# EAGLE board LDAQ-BASE (EAGLE 9.6.2)
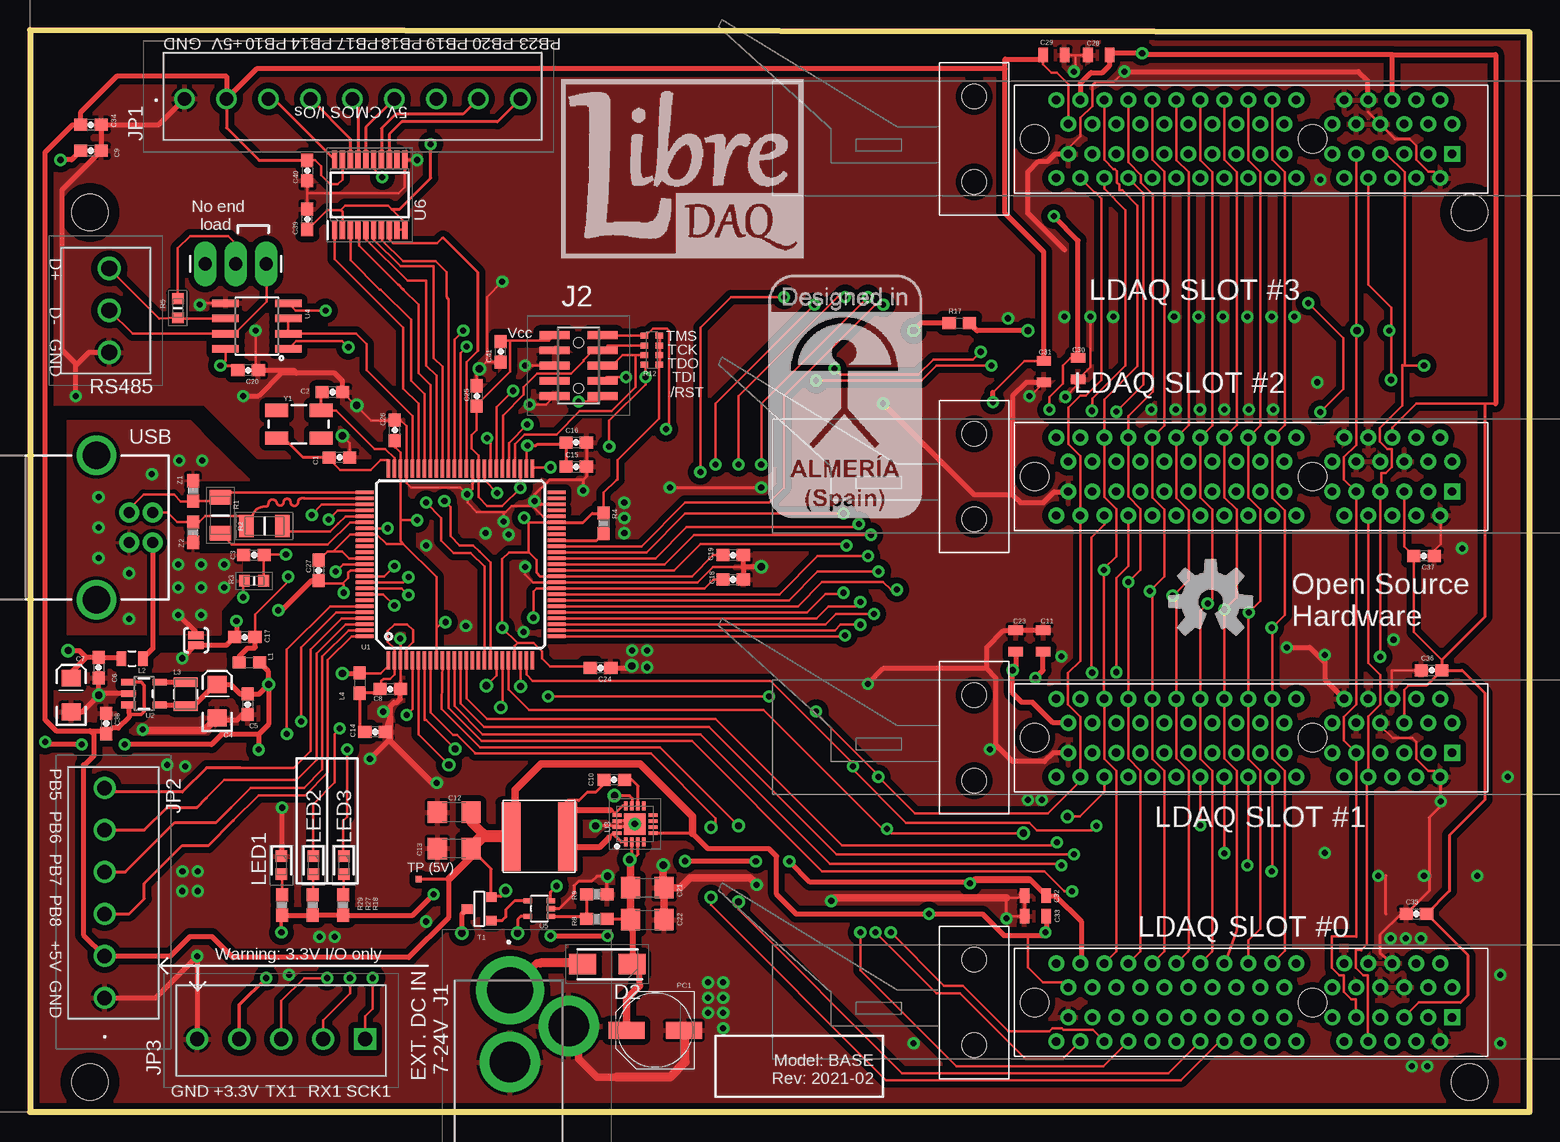
[diagram p2: board, top side]
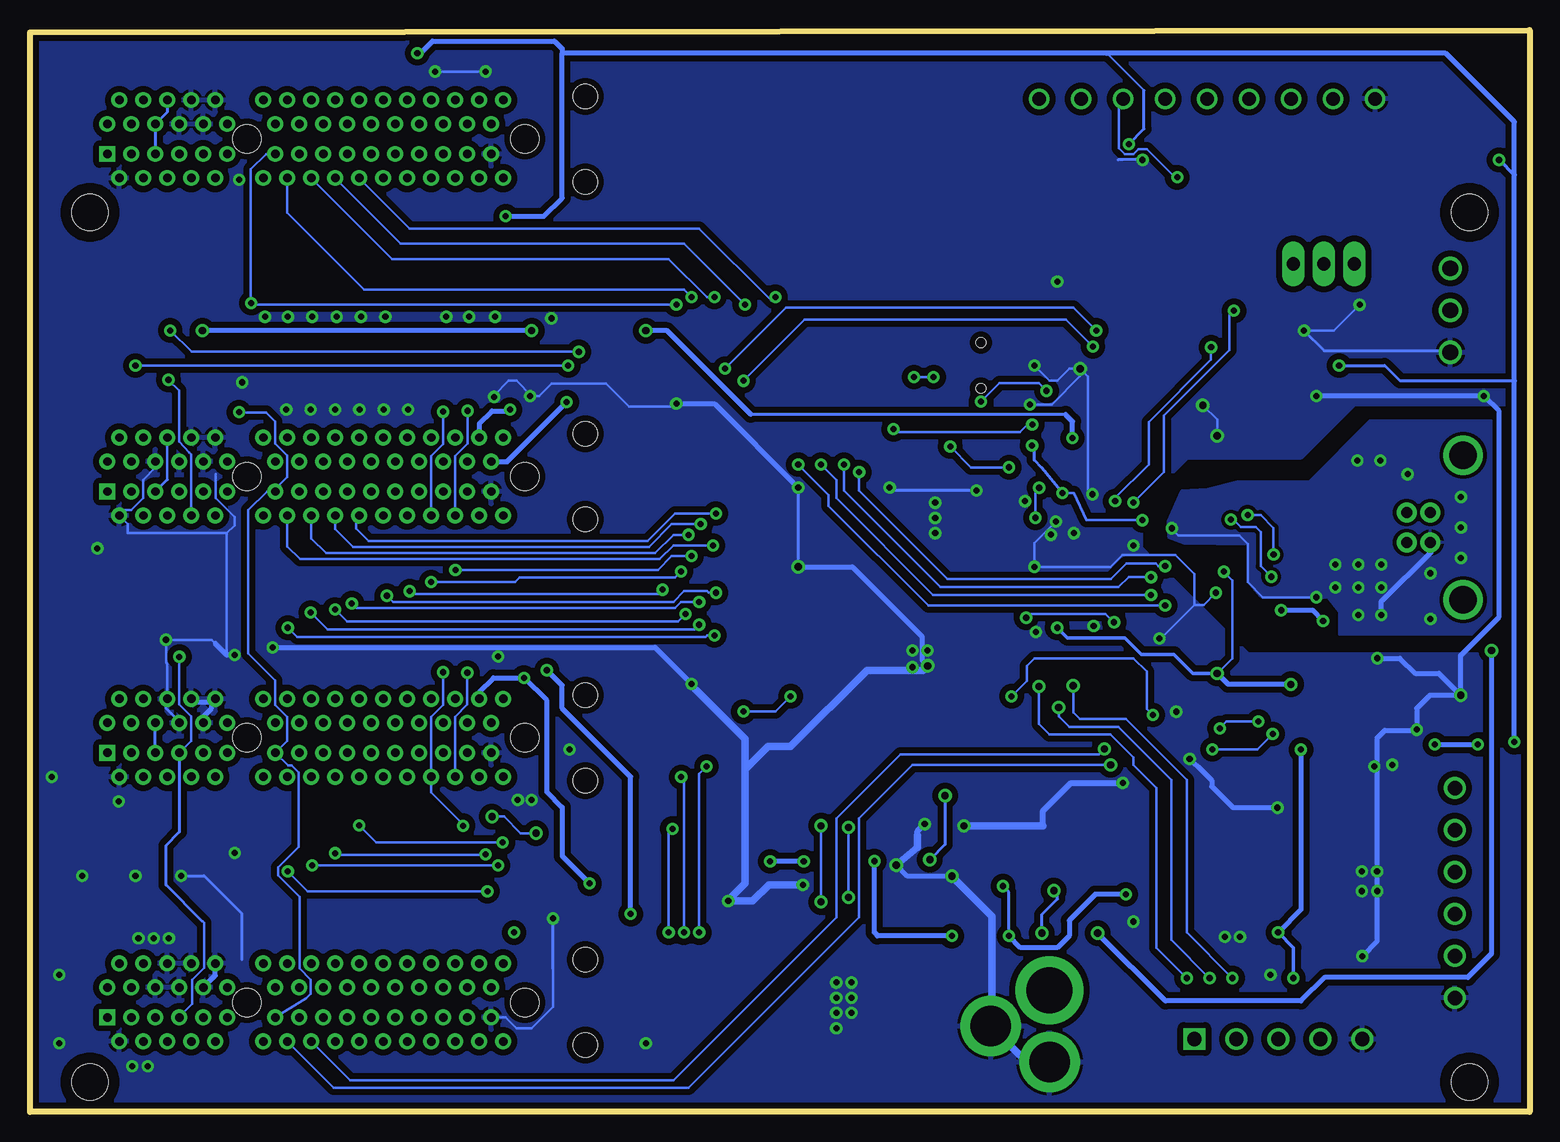
[diagram p3: board, bottom side, seen from below]

Size 125 x 90.2 mm. Coordinates in mm from the lower left corner, seen from the top.
Outline: 0,0 125,0 125,90 0,90.2 0,0
Copper layers (1*16): Top 0.035mm / dielectric 1.5mm / Bottom 0.035mm
Design rules "LibreDAQ": minimum track width 8mil, minimum drill 20mil, track to track 8mil, track to pad 7mil, pad to pad 7mil, via to via 8mil, smd to smd 7mil, copper to edge 6mil, drill to drill 8mil, minimum pad ring 12mil, minimum via ring 10mil, stop-mask expansion 4mil, vias tented up to drill 25mil, thermal gap 10mil

## Footprints (pad centres in the part's own frame; a part is rotated, then mirrored left to right if it is on the bottom)
0603-CAP = smd 1.1 x 1: 1 -0.85,0; 2 0.85,0
EIA3216 = smd 1.4 x 1.6: A 1.4,0; C -1.4,0
0805 = smd 0.8 x 1.2: 1 -0.9,0; 2 0.9,0
1206 = smd 1.6 x 1.8: 1 -1.4,0; 2 1.4,0
DIOM5025X231N = smd 2.25 x 1.7: 1 -2.05,0; 2 2.05,0
48402211 = drill 3.84 pad 5.66: 1 0,0 | drill 3.36 pad 5.04: 2 0,-6; 3 4.9,-3
M503610542 = smd 0.65 x 2.5: 1 -2.54,-2; 2 -2.54,2; 3 -1.27,-2; 4 -1.27,2; 5 0,-2; 6 0,2; 7 1.27,-2; 8 1.27,2; 9 2.54,-2; 10 2.54,2 | hole 0.8: -1.905,0; 1.905,0
393570009 = drill 1.1 pad 1.65: 1 0,0; 2 3.5,0; 3 7,0; 4 10.5,0; 5 14,0; 6 17.5,0; 7 21,0; 8 24.5,0; 9 28,0
1984659 = drill 1.2 pad 1.8: 1 0,0; 2 3.5,0; 3 7,0; 4 10.5,0; 5 14,0; 6 17.5,0
1984646 = drill 1.2 pad 1.8 square: 1 0,0 | drill 1.2 pad 1.8: 2 3.5,0; 3 7,0; 4 10.5,0; 5 14,0
691214110003 = drill 1.3 pad 1.95: 1 0,0; 2 3.5,0; 3 7,0
0603 = smd 1.1 x 1: 1 -0.85,0; 2 0.85,0
1007 = smd 2 x 0.8: 1 0,1; 2 0,-1
INDUCTOR_6028 = smd 1.6 x 5.7: 1 2.35,0; 2 -2.35,0
LEDC1608X80N = smd 0.95 x 0.95: 1 -0.75,0; 2 0.75,0
PANASONIC_D = smd 3 x 1.4: + 2.4,0; - -2.4,0
PAD-JUMPER-2-NC_BY_PASTE_YES_SILK = smd 0.635 x 1.27: 1 -0.401,0; 2 0.413,0
RESC3216X75N = smd 1.2 x 1.8: 1 -1.5,0; 2 1.5,0
RESC1608X55N = smd 0.9 x 0.95: 1 -0.8,0; 2 0.8,0
0603-RES = smd 1.1 x 1: 1 -0.85,0; 2 0.85,0
0603-ARV = smd 0.5 x 0.65: 1 -1.2,-0.625; 2 -0.4,-0.625; 3 0.4,-0.625; 4 1.2,-0.625; 5 1.2,0.625; 6 0.4,0.625; 7 -0.4,0.625; 8 -1.2,0.625
0603@1 = smd 1.1 x 1: 1 -0.85,0; 2 0.85,0
1X03_LONGPADS = drill 1.118 pad 1.88 long: 1 0,0; 2 2.54,0; 3 5.08,0
PCI-E_64_PTH_CONN = drill 0.7 square: A1 -11.65,1.25 | drill 0.7: A2 -10.65,3.25; A3 -9.65,1.25; A4 -8.65,3.25; A5 -7.65,1.25; A6 -6.65,3.25; A7 -5.65,1.25; A8 -4.65,3.25; A9 -3.65,1.25; A10 -2.65,3.25; A11 -1.65,1.25; A12 1.35,3.25; A13 2.35,1.25; A14 3.35,3.25; A15 4.35,1.25; A16 5.35,3.25; A17 6.35,1.25; A18 7.35,3.25; A19 8.35,1.25; A20 9.35,3.25; A21 10.35,1.25; A22 11.35,3.25; A23 12.35,1.25; A24 13.35,3.25; A25 14.35,1.25; A26 15.35,3.25; A27 16.35,1.25; A28 17.35,3.25; A29 18.35,1.25; A30 19.35,3.25; A31 20.35,1.25; A32 21.35,3.25; B1 -11.65,-1.25; B2 -10.65,-3.25; B3 -9.65,-1.25; B4 -8.65,-3.25; B5 -7.65,-1.25; B6 -6.65,-3.25; B7 -5.65,-1.25; B8 -4.65,-3.25; B9 -3.65,-1.25; B10 -2.65,-3.25; B11 -1.65,-1.25; B12 1.35,-3.25; B13 2.35,-1.25; B14 3.35,-3.25; B15 4.35,-1.25; B16 5.35,-3.25; B17 6.35,-1.25; B18 7.35,-3.25; B19 8.35,-1.25; B20 9.35,-3.25; B21 10.35,-1.25; B22 11.35,-3.25; B23 12.35,-1.25; B24 13.35,-3.25; B25 14.35,-1.25; B26 15.35,-3.25; B27 16.35,-1.25; B28 17.35,-3.25; B29 18.35,-1.25; B30 19.35,-3.25; B31 20.35,-1.25; B32 21.35,-3.25 | hole 2.35: 0,0; 23.15,0 | hole 2.032: 28.2,3.556; 28.2,-3.556
SOT-23 = smd 0.787 x 0.889: 1 0.025,-1.016; 2 -0.94,1.016; 3 0.991,1.016
PAD.02X.02 = smd 0.508 x 0.508: P$1 0,0
TQFP100 = smd 1.5 x 0.3: 1 -8,6; 2 -8,5.5; 3 -8,5; 4 -8,4.5; 5 -8,4; 6 -8,3.5; 7 -8,3; 8 -8,2.5; 9 -8,2; 10 -8,1.5; 11 -8,1; 12 -8,0.5; 13 -8,0; 14 -8,-0.5; 15 -8,-1; 16 -8,-1.5; 17 -8,-2; 18 -8,-2.5; 19 -8,-3; 20 -8,-3.5; 21 -8,-4; 22 -8,-4.5; 23 -8,-5; 24 -8,-5.5; 25 -8,-6; 51 8,-6; 52 8,-5.5; 53 8,-5; 54 8,-4.5; 55 8,-4; 56 8,-3.5; 57 8,-3; 58 8,-2.5; 59 8,-2; 60 8,-1.5; 61 8,-1; 62 8,-0.5; 63 8,0; 64 8,0.5; 65 8,1; 66 8,1.5; 67 8,2; 68 8,2.5; 69 8,3; 70 8,3.5; 71 8,4; 72 8,4.5; 73 8,5; 74 8,5.5; 75 8,6 | smd 0.3 x 1.5: 26 -6,-8; 27 -5.5,-8; 28 -5,-8; 29 -4.5,-8; 30 -4,-8; 31 -3.5,-8; 32 -3,-8; 33 -2.5,-8; 34 -2,-8; 35 -1.5,-8; 36 -1,-8; 37 -0.5,-8; 38 0,-8; 39 0.5,-8; 40 1,-8; 41 1.5,-8; 42 2,-8; 43 2.5,-8; 44 3,-8; 45 3.5,-8; 46 4,-8; 47 4.5,-8; 48 5,-8; 49 5.5,-8; 50 6,-8; 76 6,8; 77 5.5,8; 78 5,8; 79 4.5,8; 80 4,8; 81 3.5,8; 82 3,8; 83 2.5,8; 84 2,8; 85 1.5,8; 86 1,8; 87 0.5,8; 88 0,8; 89 -0.5,8; 90 -1,8; 91 -1.5,8; 92 -2,8; 93 -2.5,8; 94 -3,8; 95 -3.5,8; 96 -4,8; 97 -4.5,8; 98 -5,8; 99 -5.5,8; 100 -6,8
TOP23-5 = smd 0.55 x 1.2: 1 -0.95,-1.3; 2 0,-1.3; 3 0.95,-1.3; 4 0.95,1.3; 5 -0.95,1.3
QFN50P300X300X100-17N = smd 0.75 x 0.3: 1 -1.5,0.75; 2 -1.5,0.25; 3 -1.5,-0.25; 4 -1.5,-0.75; 9 1.5,-0.75; 10 1.5,-0.25; 11 1.5,0.25; 12 1.5,0.75 | smd 0.3 x 0.75: 5 -0.75,-1.5; 6 -0.25,-1.5; 7 0.25,-1.5; 8 0.75,-1.5; 13 0.75,1.5; 14 0.25,1.5; 15 -0.25,1.5; 16 -0.75,1.5 | smd 1.8 x 1.8: 17 0,0
SOIC8 = smd 0.61 x 2.21: 1 -0.635,-2.616; 2 0.635,-2.616; 3 1.905,-2.616; 4 3.175,-2.616; 5 3.175,2.616; 6 1.905,2.616; 7 0.635,2.616; 8 -0.635,2.616
SOT353-SC70-5 = smd 0.42 x 0.7: 1 -0.65,-0.95; 2 0,-0.95; 3 0.65,-0.95; 4 0.65,0.95; 5 -0.65,0.95
SOP65P640X120-20N = smd 1.475 x 0.45: 1 -2.938,2.925; 2 -2.938,2.275; 3 -2.938,1.625; 4 -2.938,0.975; 5 -2.938,0.325; 6 -2.938,-0.325; 7 -2.938,-0.975; 8 -2.938,-1.625; 9 -2.938,-2.275; 10 -2.938,-2.925; 11 2.938,-2.925; 12 2.938,-2.275; 13 2.938,-1.625; 14 2.938,-0.975; 15 2.938,-0.325; 16 2.938,0.325; 17 2.938,0.975; 18 2.938,1.625; 19 2.938,2.275; 20 2.938,2.925
STAND-OFF-TIGHT = hole 3.048: 0,0
USB-B-PTH = drill 0.914 pad 1.676: D+ 0,1.25; D- 1.981,1.25; GND 0,-1.25; VBUS 1.981,-1.25 | drill 2.286: S1 -2.718,-6.02; S2 -2.718,6.02
CRYSTAL-SMD-5X3 = smd 1.9 x 1.1: 1 -1.85,-1.15; 2 1.85,-1.15; 3 1.85,1.15; 4 -1.85,1.15

## Placement (x,y rotation side)
C1  10pF  [0603-CAP]  25.79,54.58 180 top
C2  10pF  [0603-CAP]  25.21,60.01 180 top
C3  10pF  [0603-CAP]  18.67,46.44 0 top
C4  10uF  [EIA3216]  15.61,34.25 90 top
C5  0.1uF  [0603-CAP]  18.14,33.99 270 top
C6  100nF  [0603-CAP]  5.71,37.04 270 top
C7  10uF  [EIA3216]  3.43,34.76 90 top
C8  0.1uF  [0603-CAP]  30.04,35.25 180 top
C9  0.1uF  [0603-CAP]  5.08,80.14 180 top
C10  22nF  [0603-CAP]  48.71,27.7 180 top
C11  1uF  [0805]  84.47,39.26 90 top
C12  22uF  [1206]  35.36,24.99 180 top
C13  22uF  [1206]  35.36,21.96 180 top
C14  10uF  [0603-CAP]  28.77,31.69 180 top
C15  4.7uF  [0603-CAP]  45.53,53.79 0 top
C16  0.1uF  [0603-CAP]  45.53,55.82 0 top
C17  0.1uF  [0603-CAP]  17.91,39.58 180 top
C18  0.1uF  [0603-CAP]  58.61,44.39 0 top
C19  0.1uF  [0603-CAP]  58.61,46.42 180 top
C20  1.0uF  [0603-CAP]  18.19,61.83 180 top
C21  10uF  [1206]  51.45,18.7 0 top
C22  10uF  [1206]  51.46,16.03 0 top
C23  1uF  [0805]  82.18,39.27 90 top
C24  0.1uF  [0603-CAP]  47.56,37.02 180 top
C25  0.1uF  [0603-CAP]  37.25,59.69 270 top
C26  0.1uF  [0603-CAP]  30.42,56.84 90 top
C27  0.1uF  [0603-CAP]  24.07,45.15 270 top
C28  1uF  [0805]  89.09,88.11 180 top
C29  1uF  [0805]  85.35,88.11 0 top
C30  1uF  [0805]  87.37,61.97 270 top
C31  1uF  [0805]  84.52,61.72 270 top
C32  1uF  [0805]  83.81,18.04 180 top
C33  1uF  [0805]  83.81,16.32 180 top
C34  0.1uF  [0603-CAP]  5.08,82.3 180 top
C35  0.1uF  [0603-CAP]  115.57,16.51 0 top
C36  0.1uF  [0603-CAP]  116.84,36.83 0 top
C37  0.1uF  [0603-CAP]  116.2,46.35 180 top
C38  4.7uF  [0603-CAP]  6.35,32.38 270 top
C39  0.1uF  [0603-CAP]  23.11,74.42 90 top
C40  0.1uF  [0603-CAP]  23.11,78.49 270 top
C41  0.1uF  [0603-CAP]  39.24,63.37 90 top
D2  FM4004W-W  [DIOM5025X231N]  48.13,12.32 180 top
J1  4840.2211  [48402211]  40.01,10.16 0 top
J2  M50-3610542  [M503610542]  45.72,62.23 270 top
JP1  39357-0009  [393570009]  12.88,84.46 0 top
JP2  1984659  [1984659]  6.22,9.51 90 top
JP3  1984646  [1984646]  27.94,6.08 180 top
JP6  691214110003  [691214110003]  6.6,63.33 90 top
L1  HZ0603C601R-10-0.3A  [0603]  18.29,37.48 0 top
L2  MI0805J102R-10-1A  [0805]  8.51,37.8 0 top
L3  LBR2518T2R2M  [1007]  12.97,34.84 0 top
L4  HZ0603C601R-10-0.3A  [0603]  27.5,35.76 270 top
L5  4.7uH  [INDUCTOR_6028]  42.45,22.96 0 top
LED1  150060BS75000  [LEDC1608X80N]  20.95,20.57 270 top
LED2  150060RS75000  [LEDC1608X80N]  23.62,20.57 270 top
LED3  150060RS75000  [LEDC1608X80N]  26.16,20.57 270 top
LOGO1  OSHW-LOGOL  [OSHW-LOGO-L]  98.42,42.55 0 top
PC1  47u  [PANASONIC_D]  52.11,6.81 180 top
PT1  JUMPER-PAD-2-NC_BY_PASTE  [PAD-JUMPER-2-NC_BY_PASTE_YES_SILK]  13.84,39.33 270 top
R1  CR1206-FX-39R0ELF  [RESC3216X75N]  15.88,49.74 270 top
R2  CR1206-FX-39R0ELF  [RESC3216X75N]  19.56,48.85 0 top
R3  SFR03EZPF6801  [RESC1608X55N]  18.67,44.28 0 top
R4  100k  [0603-RES]  47.82,49.09 270 top
R5  CRCW0603120RFKEAC  [RESC1608X55N]  12.32,67.01 90 top
R8  100k  [0603-RES]  47.25,16.09 0 top
R9  100k  [0603-RES]  47.25,18.16 180 top
R12  100K  [0603-ARV]  51.84,63.51 270 top
R17  39OHM  [0603@1]  77.47,65.77 0 top
R18  470  [0603-RES]  26.11,17.26 90 top
R27  470  [0603-RES]  23.57,17.26 90 top
R29  470  [0603-RES]  21.03,17.26 90 top
SJ1  JUMPER-PTH-2OF3-P0.1  [1X03_LONGPADS]  19.68,70.7 180 top
SLOT0  SLOT  [PCI-E_64_PTH_CONN]  106.91,9.13 180 top
SLOT1  SLOT  [PCI-E_64_PTH_CONN]  106.91,31.19 180 top
SLOT2  SLOT  [PCI-E_64_PTH_CONN]  106.91,52.98 180 top
SLOT3  SLOT  [PCI-E_64_PTH_CONN]  106.91,81.11 180 top
T1  FDN340P  [SOT-23]  37.45,16.96 270 top
TP_5V  TEST-POINT2  [PAD.02X.02]  32.38,19.41 0 top
U1  ATSAM3U1CB  [TQFP100]  35.88,45.66 90 top
U2  LM3671MF-3.3  [TOP23-5]  9.51,34.88 270 top
U3  TS30012-M050QFNR  [QFN50P300X300X100-17N]  50.42,24 90 top
U4  ISL3175  [SOIC8]  18.92,64.25 90 top
U5  LMV321  [SOT353-SC70-5]  42.45,16.96 90 top
U6  TXB0108PWR  [SOP65P640X120-20N]  28.32,76.45 90 top
U$1  LIBREDAQ_LOGO_MINILOGO_GENERIC  [LIBREDAQ_LOGO]  44.23,71.19 0 top
U$2  [STAND-OFF-TIGHT]  5,75 0 top
U$3  [STAND-OFF-TIGHT]  120,2.5 0 top
U$4  [STAND-OFF-TIGHT]  120,75 0 top
U$5  [STAND-OFF-TIGHT]  5,2.5 0 top
U$6  LOGO_INDALO  [LIBREDAQ_LOGO_INDALO_ALMERIA]  61.59,49.53 0 top
USB  USB-B  [USB-B-PTH]  8.26,48.73 0 top
Y1  12M  [CRYSTAL-SMD-5X3]  22.41,57.34 180 top
Z1  PESD0603-240  [0603-RES]  13.59,51.77 270 top
Z2  PESD0603-240  [0603-RES]  13.59,48.34 90 top

## Tracks (layer width: path | path; a pad name or v marks a point on that pad's centre or on a via)
1.8V  (via drill 0.51)
  Top 0.203: 30.43,55.43 30.88,54.98 U1.73 30.88,49.28 | U1.52 41.38,55.46 | 31.11,47.35 29.72,47.35 28.91,48.16 U1.83 26.7,48.16 25.27,46.74 | 31.11,47.35 33.88,44.59 33.88,40.37 | C18.1 56.96,44.4 56.23,43.66 U1.34 42.24,43.66 41.96,43.38 v41.96,41.21 | U1.9 33.88,40.37 | U1.59 37.88,52.67 v38.94,51.61 | v34.63,40.83 34.33,40.83 33.88,40.37 | 30.88,49.28 30.88,47.59 31.11,47.35 | v32.27,49.34 30.94,49.34 30.88,49.28 | 25.27,46.74 24.8,46.74 C27.1 | U1.87 26.61,46.16 26.04,46.74 25.27,46.74
  Top 0.254: 30.43,55.43 30.43,55.97 C26.1 | 41.38,55.46 v41.47,55.55 42.16,55.55 42.29,55.67 44.53,55.67 C16.1 C15.1
  Bottom 0.203: v38.94,51.61 37.96,51.61 36.96,49.34 v32.27,49.34 | v34.63,40.83 35.34,41.53 41.51,41.53 v41.96,41.21
  Bottom 0.254: v38.94,51.61 40.64,53.7 41.27,54.34 41.27,55.36 v41.47,55.55
3.3V  (via drill 0.51, 0.6)
  Top 0.203: 27.45,36.56 L4.1 27.54,36.56 29.21,36.56 29.88,37.23 U1.1 | U1.22 40.38,38.84 40.64,39.1 | 40.64,39.1 41.97,39.1 42.67,38.4 42.67,37.83 43.37,37.13 46.6,37.13 C24.2 | C19.2 56.93,46.42 55.17,44.66 U1.36 42.52,44.66 42.22,44.97 42.22,46.03 41.6,46.64 | 40.64,39.1 v39.37,40.37 39.37,46.09 39.93,46.64 41.6,46.64 | U1.53 v40.88,52.04 39.37,50.53 38.1,50.53 37.38,51.25 U1.60 37.38,54.74 36.83,55.29 36.83,56.44 37.25,56.86 C25.2 37.25,58.94 40.03,61.72 40.03,64.31 | U1.45 41.56,49.16 | 41.56,49.16 v41.19,49.54 | U1.88 26.11,45.66 v25.49,45.04 | 41.56,49.16 41.56,46.68 41.6,46.64 | R4.1 47.82,51.63 48.9,52.7 48.97,52.73 48.97,54.36 52.43,57.81 52.43,62.28 R12.5 | SLOT2.B6 113.56,57.04 115.57,59.05 122.17,59.05 | SLOT1.B5 114.56,35.18 114.94,35.56 | SLOT2.A5 114.56,47.16 C37.2 115.36,40.02 117.69,37.68 | v78.36,19.05 78.34,19.03 | U6.2 26.05,75.05 25.91,75.18 | C39.1 23.15,73.57 24.77,75.18 25.91,75.18 | 25.91,75.18 26.29,75.56 29.84,75.56 30.16,75.25 31.11,74.3 31.11,73.52 U6.10 31.09,73.56 30.68,73.56 U6.9 | v15.88,62.23 16.31,62.66 U4.8 | 40.03,64.31 43.28,64.31 43.69,64.72 J2.1 | 40.03,64.31 39.32,64.31 C41.2 | v84.99,58.55 84.99,59.59 86.11,60.71 86.11,62.23 86.75,62.87 C30.1 | 119.26,9.12 115.75,9.12 114.62,8 SLOT0.A5
  Top 0.254: R12.8 R12.7 R12.6 R12.5 | U5.3 43.4,18.34 v43.89,18.83 | C20.2 16.94,62.23 v15.88,62.23 | U1.45 46.11,49.16 46.86,49.91 47.8,49.91 R4.1 | 119.26,9.12 119.89,9.75 119.89,13.04 C35.2 118.33,18.41 118.33,23.07 121.28,26.04 121.28,34.92 119.38,36.83 C36.2 | C36.2 116.42,35.56 114.94,35.56 | 121.28,59.05 121.28,41.27 117.69,37.68 C36.2 | 30.16,75.25 30.8,75.25 33.4,77.85 v33.4,80.7 33.4,80.9
  Top 0.305: JP3.4 17.44,8.91 v19.68,11.16 | v20.95,14.97 20.95,16.33 R29.1
  Top 0.406: v26.04,36.56 27.45,36.56 | v19.89,35.65 19.89,32.32 19.05,31.48 | 19.05,31.48 15.96,31.48 15.13,30.64 v7.89,30.64 | v4.3,30.64 1.47,30.64 v1.27,30.84 | v19.89,35.65 19.89,36.73 L1.2 | v19.89,35.65 19.09,34.84 C5.1 17.54,34.84 16.73,35.65 C4.A 15.26,35.31 15.11,35.31 13.65,33.84 L3.2 12.88,33.93 U2.4 | R29.1 R27.1 R18.1 31.92,16.41 v33.66,18.14 | v43.4,14.68 v48.16,14.68 | v54.61,20.91 60.48,20.91 v60.5,20.89 | 19.05,31.48 v19.05,30.21 | C9.2 3.47,79.38 v2.54,79.38 | 113.56,88.16 92.82,88.16 v92.71,88.27 90.14,88.27 C28.1 89.99,87.24 89.41,86.66 88.46,86.66 87.56,85.76 SLOT3.B30 | 113.56,88.16 122.17,88.16 122.17,59.05 | SLOT3.B6 113.56,88.16 | 87.51,62.74 C30.1 87.37,72.65 v85.34,74.68 | v63.3,20.89 65.02,19.16 78.49,19.16 78.76,19.43 83.32,19.43 83.44,19.31 | v83.82,36.2 84.45,36.83 84.45,38.34 C11.1 | SLOT0.B30 87.63,12.46 87.63,15.88 85.47,18.04 C32.1 83.44,19.31 | v78.36,19.05 78.62,19.31 83.44,19.31
  Bottom 0.203: v41.19,49.54 41.19,51.73 v40.88,52.04 | v26.04,36.56 24.77,37.83 24.77,44.32 v25.49,45.04 | SLOT2.B6 113.56,52.73 | 35.23,88.27 32.13,85.17
  Bottom 0.254: v43.4,14.68 43.4,18.34 v43.89,18.83 | 1.27,60.96 10.79,60.96 12.06,62.23 v15.88,62.23 | SLOT3.B6 113.56,83.36 SLOT3.B5 SLOT3.A5 | 113.56,52.73 SLOT2.A5 | SLOT1.A5 SLOT1.B5 | v33.4,80.7 32.13,81.97 32.13,85.17
  Bottom 0.305: v26.04,36.56 28.05,36.56 29.64,38.15 32.35,38.15 33.72,39.52 38.52,39.52 v39.37,40.37 | v19.68,11.16 19.68,13.7 v20.95,14.97 | v2.54,79.38 1.27,78.11
  Bottom 0.406: v19.89,35.65 25.12,35.65 v26.04,36.56 | v7.89,30.64 v4.3,30.64 | v1.27,30.84 1.27,60.96 1.27,78.11 1.27,82.55 6.99,88.27 35.23,88.27 80.64,88.27 | v33.66,18.14 36.2,18.14 38.37,15.97 38.37,14.7 39.37,13.7 42.42,13.7 v43.4,14.68 | v48.16,14.68 54.37,14.68 54.37,14.73 54.61,14.97 v54.61,20.91 | v60.5,20.89 v63.3,20.89 | v19.05,30.21 19.05,16.88 v20.95,14.97 | v92.71,88.27 92.46,88.27 91.44,89.28 81.28,89.28 80.64,88.65 80.64,88.27 | v84.99,58.55 85.09,58.45 86.49,58.45 87.56,57.38 SLOT2.B30 | v85.34,74.68 82.17,74.68 80.64,76.2 80.64,88.27 | SLOT1.B30 87.56,35 86.36,36.2 v83.82,36.2 81.92,34.29 81.92,26.67 80.64,25.4 80.64,21.34 v78.36,19.05
!JTAG_RESET  (via drill 0.51)
  Top 0.203: v40.26,60.12 38.91,58.78 38.91,53.75 U1.57 | v45.72,59.23 47.24,59.23 47.65,59.64 J2.10
  Bottom 0.203: v45.72,59.23 44.2,60.76 40.89,60.76 v40.26,60.12
!LED1  (via drill 0.51)
  Top 0.203: U1.96 25.54,41.66 22.59,38.72 v22.59,32.55 | v25.82,31.99 25.82,31.91 25.4,31.5 25.4,27.47 23.58,25.65 23.58,21.36 LED2.1
  Bottom 0.203: v22.59,32.55 25.26,32.55 v25.82,31.99
!LED2  (via drill 0.51)
  Top 0.203: v26.44,30.22 26.44,24.58 26.11,24.25 26.11,21.38 LED3.1 | v21.41,31.52 21.41,38.57 25.01,42.16 U1.95
  Bottom 0.203: v26.44,30.22 22.71,30.22 v21.41,31.52
+5V  (via drill 0.51, 0.6)
  Top 0.203: 84.65,16.25 C33.1 | SLOT3.B31 86.56,85.7 85.6,86.66 85.15,86.66 84.45,87.36 C29.1 | 84.72,15.04 v84.65,14.97 | U6.19 26.05,77.73 25.65,77.34 25.02,77.34 24.26,78.11 24.26,78.87 23.79,79.34 23.5,79.34 C40.1 | SLOT0.B31 86.14,10.79 84.45,10.79 83.19,12.06 83.19,14.72 | 80.26,59.99 82.89,62.62 C31.1
  Top 0.254: 40.45,23.42 40.45,23.31 L5.2 | U5.5 40.9,16.31 40.65,16.06 v40.65,14.92 | v39.65,18.46 39.65,18.36 39.25,17.96 38.53,17.96 T1.2 38.45,17.91 38.45,20.26 C13.1 | TP_5V.P$1 34.92,19.41 | 55.24,23.23 55.23,23.21 55.18,23.25 U3.5 | JP1.2 16.38,82.05 19.09,79.34 23.5,79.34
  Top 0.305: 84.4,14.72 v84.65,14.97 | U2.1 9.25,35.83 9.53,35.56 9.53,33.4 9.27,33.15 8.38,33.15 8.26,33.27 | 8.26,33.89 U2.3 | 6.1,31.79 C38.2
  Top 0.406: 34.92,19.41 34.92,16.24 31.57,12.88 16.91,12.88 15.16,14.63 13.34,14.63 11.71,13.01 JP2.2 4.45,14.79 4.45,28.94 4.56,28.94 5.33,29.72 5.33,31.44 4.99,31.79 | 84.4,14.72 83.19,14.72 81.17,14.72 79.38,16.51 v74.93,16.51 74.91,16.49 63.88,16.49 62.23,18.14 62.23,21.32 61.59,21.95 56.52,21.95 55.24,23.23 | 4.99,31.79 2.17,31.79 1.27,32.69 1.27,80.01 3.56,82.3 C34.2 4.23,83.35 7.21,86.33 16.38,86.33 JP1.2 18.89,86.97 81.28,86.97 | C33.1 84.72,15.04 | C29.1 84.12,87.78 81.28,87.78 81.28,86.97 | v80.26,59.18 80.26,59.99 | 84.52,63.51 C31.1 84.52,71.69 81.28,74.93 81.28,86.97 | C23.1 82.18,37.09 v81.92,36.83 81.92,34.92 82.68,34.16 83.57,34.16 85.29,32.44 SLOT1.B31 | 8.26,33.89 8.26,33.27 8.26,32.89 7.37,32 6.82,32 C38.2 | 4.99,31.79 6.1,31.79
  Top 0.61: L5.2 39.99,22.96 | C13.1 36.76,21.25 34.92,19.41 | 40.45,23.42 40.45,26.85 42.62,29.02 50.85,29.02 55.24,24.62 55.24,23.23
  Top 0.813: 37.73,22.96 37.73,23.23 36.83,24.13 36.83,24.92 C12.1
  Top 1.016: 39.99,22.96 37.73,22.96 36.76,21.98 C13.1
  Bottom 0.254: v40.65,14.92 40.65,16.46 39.35,17.76 39.35,18.16 v39.65,18.46
  Bottom 0.406: SLOT2.B31 85.22,54.23 v80.26,59.18 | v74.93,16.51 74.93,27.94 80.64,33.66 80.64,35.56 v81.92,36.83
BUS_CLK  (via drill 0.6)
  Top 0.203: 110.56,14.62 SLOT1.A9 109.54,30.96 109.54,32.94 110.56,33.96 SLOT2.A9 109.54,52.74 109.54,54.59 110.56,55.61 110.56,65.07 v110.62,65.14 110.56,65.2 SLOT3.A9 | 110.56,14.62 110.56,14.61 | 110.56,14.62 108.5,14.62 108.5,12 109.12,11.38 109.5,11.38 109.5,10 110.12,9.38 110.5,9.38 110.5,8 SLOT0.A9
  Top 0.406: v83.19,65.14 78.95,65.14 R17.2
  Bottom 0.406: v83.19,65.14 v110.62,65.14
CMP
  Top 0.254: R9.2 R8.1 46.25,16.31 U5.1
D0  (via drill 0.51)
  Top 0.203: U1.26 67.87,39.66 v67.94,39.73 | SLOT3.B14 103.56,79.37 104.58,78.34 104.58,57.26 SLOT2.B14 103.56,51.18 104.58,50.15 104.58,41.45 v103.5,40.37 103.56,40.32 SLOT1.B14 103.56,29.46 104.58,28.43 104.58,13.41 SLOT0.B14
  Bottom 0.203: v103.5,40.37 102.74,39.61 68.71,39.61 68.58,39.73 v67.94,39.73
D1  (via drill 0.51)
  Top 0.203: U1.27 67.1,40.16 67.56,40.62 v69.22,40.62 | SLOT3.B16 101.56,79.34 102.55,78.34 102.55,57.22 SLOT2.B16 101.56,51.21 102.55,50.21 102.55,42.59 v101.6,41.64 101.56,41.59 SLOT1.B16 101.56,29.43 102.55,28.43 102.55,15.29 101.56,14.29 SLOT0.B16
  Bottom 0.203: v69.22,40.62 69.6,40.24 100.2,40.24 v101.6,41.64
D2  (via drill 0.51)
  Top 0.203: U1.28 66.33,40.66 67.18,41.51 v70.36,41.51 | SLOT3.B18 99.56,79.37 100.58,78.34 100.58,57.25 SLOT2.B18 99.56,51.24 100.58,50.21 100.58,42.91 v99.57,41.89 99.56,41.88 SLOT1.B18 99.56,29.46 100.58,28.43 100.58,15.13 99.66,12.49 SLOT0.B18
  Bottom 0.203: v99.57,41.89 98.55,40.88 70.99,40.88 v70.36,41.51
D3  (via drill 0.51)
  Top 0.203: U1.29 65.56,41.16 66.55,42.15 68.83,42.15 v69.22,42.53 | SLOT3.B20 97.56,79.34 98.55,78.34 98.55,57.22 SLOT2.B20 97.56,51.21 98.55,50.21 98.55,42.78 v98.17,42.4 97.56,41.79 SLOT1.B20 97.56,29.43 98.55,28.43 98.55,13.44 98.52,13.35 SLOT0.B20
  Bottom 0.203: v98.17,42.4 97.79,42.02 71.25,42.02 70.74,42.53 v69.22,42.53
D4  (via drill 0.51)
  Top 0.203: U1.30 64.79,41.66 66.29,43.16 67.69,43.16 v67.82,43.29 | SLOT3.B22 95.56,79.37 96.58,78.34 96.58,57.25 SLOT2.B22 95.56,51.18 96.58,50.15 96.58,44.37 v95.25,43.04 95.56,42.73 SLOT1.B22 95.56,29.46 96.58,28.43 96.58,13.51 96.53,13.36 SLOT0.B22
  Bottom 0.203: v67.82,43.29 68.45,43.29 68.58,43.42 70.48,43.42 71.37,42.53 94.74,42.53 v95.25,43.04
D5  (via drill 0.51)
  Top 0.203: U1.31 64.02,42.16 66.04,44.18 71.12,44.18 71.75,43.55 v72.26,43.55 | SLOT3.B24 93.56,79.4 94.55,78.41 94.55,57.22 SLOT2.B24 93.56,51.21 94.55,50.21 94.55,44.62 v93.34,43.42 93.56,43.42 SLOT1.B24 93.56,29.43 94.55,28.43 94.55,13.38 SLOT0.B24
  Bottom 0.203: v72.26,43.55 72.64,43.16 93.09,43.16 v93.34,43.42
D6  (via drill 0.51)
  Top 0.203: U1.32 63.25,42.66 65.66,45.07 v70.74,45.07 | SLOT0.B26 92.58,13.41 92.58,28.43 91.56,29.46 SLOT1.B26 91.56,44.17 v91.57,44.18 92.58,45.2 92.58,50.28 91.56,51.3 SLOT2.B26 91.56,58 93.6,60.05 93.6,76.5 92.62,77.47 92.62,78.11 91.56,79.18 SLOT3.B26
  Bottom 0.203: v91.57,44.18 84.58,44.18 84.2,44.56 71.25,44.56 v70.74,45.07
D7  (via drill 0.51)
  Top 0.203: U1.33 62.48,43.16 65.66,46.34 v69.85,46.34 | SLOT3.B28 89.56,79.38 90.32,78.61 90.42,78.61 90.62,78.42 90.62,77.47 90.81,77.29 90.81,76.83 91.06,76.83 92.33,75.56 92.33,62.17 89.56,59.4 SLOT2.B28 89.56,51.27 90.55,50.28 90.55,46.32 89.53,45.3 v89.53,45.2 89.53,34.46 SLOT1.B28 89.56,29.43 90.55,28.43 90.55,13.38 SLOT0.B28
  Bottom 0.203: v89.53,45.2 72.64,45.2 71.5,46.34 v69.85,46.34
FB_PWR5
  Top 0.254: 44.45,24.71 44.31,24.71 44.2,24.59 44.2,23.35 L5.1 | 44.33,24.83 44.2,24.96 44.2,25.35 44.8,25.96 45.75,25.96 46.45,26.66 47.15,26.66 47.86,27.36 C10.2 | 44.33,24.83 44.45,24.71 | L5.1 44.28,22.48 44.68,22.08 44.7,22.06 | 44.93,25.43 44.74,25.24 44.33,24.83 | 44.45,24.71 44.7,24.96 | 45,22.76 L5.1 | 48.77,24.9 U3.13 | 48.77,24.9 48.53,25.15 48.39,25.15 | U3.12 49.38,25.5 48.77,24.9 | U3.16 48.65,23.25 48.58,23.18 | 48.58,23.18 48.26,22.86 | U3.1 49.25,22.5 48.58,23.18
  Top 0.508: 48.26,22.86 47.48,22.08 44.68,22.08 | 48.39,25.15 44.83,25.15 44.74,25.24
GND  (via drill 0.51, 0.6)
  Top 0.203: 30.87,57.69 31.38,57.18 U1.72 31.38,52.44 31.75,52.07 35.87,52.07 v36.45,51.49 | U4.5 14.29,67.42 v14.16,67.29 | C20.1 18.8,62.08 v18.8,65.14 | C18.2 59.29,44.39 59.29,44.42 | C29.2 87.15,88.11 | 87.15,88.11 C28.2 | 59.5,45.45 59.37,45.32 59.27,45.42 56.92,45.42 55.66,44.16 U1.35 41.93,44.16 41.27,44.81 v41.27,45.45 | C8.1 30.88,35.26 U1.3 30.88,39.47 v30.86,39.48 | C1.1 26.64,55.76 v26.04,56.37 | C2.1 27.16,58.91 v27.24,58.91 27.24,58.85 28.45,57.64 30.37,57.64 C26.2 | 36.88,52.39 36.88,51.92 v36.45,51.49 | 42.04,51.42 42.04,50.66 41.91,50.53 | 41.91,50.53 40.16,50.53 39.66,50.03 | 39.66,50.03 37.22,50.03 36.46,50.8 36.46,51.48 v36.45,51.49 | U1.46 42.78,49.66 41.91,50.53 | U1.89 26.71,45.16 26.52,44.97 26.52,44.51 26.06,44.05 | 26.06,44.05 24.32,44.05 C27.2 | v26.14,43.29 26.14,43.98 26.06,44.05 | v39.47,49.23 39.47,49.84 39.66,50.03 | 37.4,61.9 v37.47,61.96 | v37.47,61.96 37.25,61.74 C25.1 | SLOT3.B7 112.56,82.34 | 114.99,81.13 115.55,80.57 115.55,79.4 116.56,78.38 117.03,78.38 SLOT3.A2 | SLOT1.B7 112.56,32.2 113.59,31.17 115.21,31.17 115.55,30.84 115.55,29.44 116.56,28.42 117.07,28.42 SLOT1.A2 | SLOT3.A31 86.56,80.33 87.55,81.33 87.55,82.88 88.54,83.87 88.54,85.55 88.88,85.88 90.37,85.88 v91.24,86.74 | 87.15,88.11 87.15,86.87 v87.02,86.74 | C36.1 113.54,36.83 113.54,34.46 SLOT1.B6 | C37.1 117.06,46.82 117.6,47.37 117.6,49.68 SLOT2.A2 | C40.2 23.11,76.58 | 23.11,76.58 C39.2 | U6.11 31.25,77.09 30.73,76.58 23.11,76.58 | v41.27,62.23 J2.5 | J2.9 43.02,58.99 v41.66,58.99 | v37.47,61.96 38.03,62.52 38.1,62.52 | 38.1,62.52 C41.1 | 38.1,62.52 38.1,67.94 v39.37,69.22 | 81.41,17.84 82.35,17.84 82.73,18.22
  Top 0.203: v81.41,16.13 81.6,16.32 C33.2 | v88.39,66.29 88.39,62.09 C30.2 87.37,60.68 v86.31,59.62 | C31.2 83.39,59.69 v83.31,59.69 | LED1.1 21,21.28 21,21.23
  Top 0.254: 52.53,20.78 52.53,20.54 v52.78,20.59 | R9.1 48.1,19.61 v48.15,19.66 47.25,19.66 46.85,19.26 45.75,19.26 45.35,18.86 45.35,18.18 44.13,16.96 U5.2 | C26.2 30.87,57.69 | C32.2 C33.2 | U1.61 36.88,52.39 | C16.2 C15.2 | U1.48 42.04,50.66 | 42.04,50.66 41.91,50.53 | C15.2 46.38,52.97 46.1,52.69 43.31,52.69 42.04,51.42 42.04,50.66 | 111.56,83.36 SLOT3.B7 | 112.56,82.34 113.77,81.13 114.99,81.13 | C15.2 46.38,52.98 46.1,52.7 v46.1,51.82 | v53.34,52.07 v60.96,52.07 | v81.41,16.13 81.41,17.84 | SLOT0.B6 112.54,13.27 112.54,14.75 114.3,16.51 C35.1 116.62,18.41 116.62,24.55 117.56,25.48 SLOT1.A2 | 113.03,16.51 113.03,19.68 v112.39,19.68 | 50.17,24.25 U3.14 U3.15 | 50.16,23.75 U3.15 | U3.15 48.82,23.86 v47.15,23.86 | U6.11 32.24,79.39 v32.26,79.38
  Top 0.305: 82.14,40.13 C23.2 | C11.2 | 5.87,34.88 v5.74,34.74
  Top 0.406: C6.2 5.74,36.17 v5.74,34.74 4.34,33.35 C7.C | C5.2 17.73,33.14 17.23,32.65 15.81,32.65 C4.C | v60.96,45.45 59.5,45.45 | 59.5,45.45 59.5,44.43 C18.2 | 59.5,45.45 59.5,46.38 C19.1 | C14.1 30.06,32.96 | 31.11,35.02 C8.1 30.86,35.22 30.86,34.42 30.61,34.16 30.35,34.16 30.06,33.87 30.06,32.96 | C27.2 23.49,44.3 21.02,41.83 v20.7,41.83 | v17.21,40.94 17.21,39.73 C17.2 16.39,38.91 PT1.2 13.78,38.91 v12.7,37.83 | JP3.5 v13.95,12.99 10.46,9.51 JP2.1 | 30.06,32.96 30.06,31.16 | 30.06,31.16 29.93,31.03 v28.33,29.44 | v21.01,25.38 v21.01,25.37 21,21.23 | 30.06,31.16 30.06,30.94 | C24.1 49.99,37.02 v50.16,37.2 | v17.78,59.69 19.05,59.69 20.95,61.59 22.23,61.59 | C20.1 21.99,61.83 22.23,61.59 | C2.1 26.06,60.94 25.4,61.59 22.23,61.59 | v3.81,59.69 3.81,62.23 | 3.81,62.23 3.81,62.38 2.67,63.52 2.67,76.87 C9.1 C34.1 10.71,82.3 JP1.1 | JP6.1 4.91,63.33 3.81,62.23 | v91.24,86.74 110.74,86.74 111.48,86 111.48,84.43 | C30.2 87.12,60.82 | C31.2 83.04,60.82 81.92,59.69 81.92,51.44 | SLOT2.A31 86.52,51.69 85.37,51.69 84.48,50.8 82.55,50.8 81.92,51.44 | 86.23,71.88 83.19,74.93 83.19,78.36 84.07,79.25 84.84,79.25 85.47,79.88 86.53,79.88 SLOT3.A31 | 81.92,51.44 78.74,51.44 v71.12,59.05 | SLOT1.A31 85.31,29.94 84.58,29.21 81.92,29.21 80.52,30.61 80.52,36.2 79.76,36.96 | 79.76,36.96 79.76,38.73 81.15,40.13 82.14,40.13 | C23.2 C11.2 | 79.76,36.96 71.12,36.96 v69.85,35.69 | v104.78,38.73 106.68,38.73 107.63,37.78 | 107.63,37.78 107.95,37.47 107.95,36.07 | 107.95,36.07 107.95,36.05 | U2.2 5.87,34.88 | 107.95,36.07 109.6,34.39 | v107.95,38.1 107.63,37.78
  Top 0.508: v33.91,27.43 33.53,27.43 29.93,31.03 | U3.17 50.17,23.75 50.16,23.75
  Top 0.61: C21.2 C22.2 | v52.78,20.59 52.78,18.77 C21.2 | 54.61,6.71 PC1.- | C4.C 15.55,32.85 14.53,31.82 9.42,31.82 | C21.2 54.2,18.7 55.02,19.52 60.01,19.52 v60.58,18.95 | 81.41,17.84 67.04,17.84 v66.79,17.59 | 82.73,18.22 C32.2 | J1.3 45.72,6.34 45.72,4.45 47.26,2.9 49.53,2.9
  Top 0.762: 48.93,2.9 49.53,2.9 53.34,2.9 54.61,4.17 54.61,6.71
  Bottom 0.203: v18.8,65.14 16.32,65.14 v14.16,67.29 | v26.04,56.37 26.04,57.71 v27.24,58.91 | v36.45,51.49 36.83,51.88 36.83,61.33 v37.47,61.96 | 27.94,42.27 27.94,44.87 29.53,46.45 33.92,46.45 34.92,45.45 v41.27,45.45 41.27,47.43 v39.47,49.23 | 27.94,42.27 27.15,42.27 v26.14,43.29 | v30.86,39.48 30.73,39.48 27.94,42.27 | SLOT2.B5 114.56,53.72 115.57,52.7 115.57,51.18 116.56,50.19 117.09,50.19 SLOT2.A2 116.84,49.01 116.84,48.26 108.58,48.26 | SLOT1.B7 112.56,32.55 | 109.53,53.2 109.53,51.18 107.95,49.61 107.95,48.9 108.58,48.26 | v91.24,86.74 v87.02,86.74 | 109.56,39.07 109.86,39.37 v113.67,39.37 113.67,37.47 113.56,37.35 SLOT1.B6 | 108.58,48.26 108.58,38.1 | v37.47,61.96 38.37,61.96 39.37,60.96 40.01,60.96 v41.27,62.23 | v41.66,58.99 39.82,58.99 37.47,61.34 v37.47,61.96 | 81.41,12.7 81.41,8.76 83.19,6.99 84.45,6.99 85.36,7.88 SLOT0.A31 | v83.31,59.69 83.19,59.69 | 83.19,59.69 82.55,59.69 81.53,60.71 76.96,60.71 75.06,58.8 71.37,58.8 v71.12,59.05 | v86.31,59.62 86.31,59.74 85.09,60.96 84.45,60.96 83.19,59.69
  Bottom 0.254: v18.8,65.14 17.12,63.46 6.73,63.46 JP6.1 | 112.56,32.55 113.67,33.66 113.67,34.33 SLOT1.B6 | v46.1,51.82 53.09,51.82 v53.34,52.07 | v60.96,52.07 60.96,45.47 | 81.41,11.94 81.41,12.7 v81.41,16.13 | v112.39,19.68 110.49,19.68 107.31,16.51 107.31,12.72 | v32.26,79.38 34.29,79.38
  Bottom 0.406: v48.15,19.66 51.85,19.66 v52.78,20.59 | v20.7,41.83 18.1,41.83 v17.21,40.94 | 9.53,31.82 12.06,31.82 12.7,31.19 v12.7,20.07 v12.71,20.06 12.71,14.23 v13.95,12.99 | 9.53,31.82 9.42,31.82 | v12.7,37.83 10.79,37.83 9.53,36.56 7.55,36.56 v5.74,34.74 | v28.33,29.44 27.66,28.8 26.48,27.62 26.48,27.13 24.73,25.38 v21.01,25.38 | v60.96,45.45 56.45,45.45 50.63,39.63 50.63,37.66 v50.16,37.2 | v5.74,34.74 5.74,38.08 2.54,41.27 2.54,58.42 v3.81,59.69 v17.78,59.69 | v71.12,59.05 67.94,59.05 v60.96,52.07 | v104.78,38.73 72.9,38.73 v69.85,35.69 | v5.74,34.74 8.31,34.74 9.4,33.66 9.4,31.95 9.53,31.82 | SLOT1.B9 110.56,32.95 109.86,33.66 109.86,34.14 | 109.86,34.14 SLOT1.B10 | v107.95,38.1 108.58,38.1 109.56,39.07 | 109.86,34.14 111.25,34.14 SLOT1.B8 | SLOT0.B9 109.56,11.38 SLOT0.B10
  Bottom 0.508: 40.55,23.86 40.55,25.11 38.23,27.43 v33.91,27.43 | 51.01,23.07 51.01,23.42 U3.17
  Bottom 0.61: 51.01,23.07 51.01,22.07 v52.78,20.59 | v47.15,23.86 40.55,23.86 | v48.15,19.66 44.81,16.31 44.81,7.25 J1.3 41.91,4.16 J1.2 | v60.58,18.95 63.4,18.95 64.76,17.59 v66.79,17.59 66.79,17.67 65.41,19.05 65.41,28.57 | 65.41,28.57 63.5,30.48 61.59,30.48 55.24,36.83 50.55,36.83 50.29,37.08 | 65.41,28.57 65.41,31.11 69.85,35.56 v69.85,35.69
  other vias: 21.59,11.43 57.78,6.99 73.66,5.71 107.95,21.59 116.2,19.68 120.65,19.68 122.56,5.71 122.56,11.43 123.19,27.94 81.53,66.17 86.23,66.29 90.3,66.29 95.38,66.29 97.41,66.29 99.44,66.29 101.47,66.29 103.5,66.29 93.47,58.55 95.5,58.55 97.54,58.55 99.57,58.55 101.6,58.55 103.63,58.55 105.41,66.29 107.57,77.72 12.94,28.8 29.45,33.38 41.15,40.01 85.98,37.97 80.01,30.23 9.4,31.88 50.42,24 119.38,46.99 107.31,60.83 57.78,8.26 57.78,9.53 57.78,10.79 56.52,10.79 56.52,9.53 56.52,8.26 24.13,14.61 25.4,14.61 33.02,15.88 12.7,18.41 13.98,20.06 13.97,18.41 11.44,28.95 83.19,26.03 84.34,26.03 113.42,14.47 114.69,14.47 115.96,14.47 116.47,3.8 115.2,3.8 117.61,25.9 37.98,48.25 39.89,48.13 33.03,47.24 36.33,40.51 42.05,50.92 49.54,48.25 49.54,49.52 49.54,50.79 50.17,38.48 51.45,38.48 51.45,37.08
  pour Bottom (isolate 0.508): 0,90 125,90 125,0.64 0.64,0.64 0.64,38.1 23.5,38.1 32.38,46.99 32.38,50.8 28.57,54.61 19.05,54.61 14.61,59.05 0,59.05
  pour Top (isolate 0.508): 0,90 125,90 125,0.64 0.64,0.64 0.64,38.1 23.5,38.1 32.38,46.99 32.38,50.8 28.57,54.61 19.05,54.61 14.61,59.05 0,59.05
JTAG_TCK
  Top 0.203: R12.2 48.16,63.91 47.75,63.5 J2.4 46.94,63.5 46.13,62.69 46.13,62.59 45.11,61.57 42.27,61.57 41.15,60.45 41.15,59.79 39.42,58.06 39.42,53.75 U1.56
JTAG_TDI  (via drill 0.51)
  Top 0.203: v49.68,61.27 48.06,61.27 47.75,60.96 J2.8 | R12.4 51.31,62.28 v51.31,61.27 51.31,60.66 48.28,57.63 v48.28,55.47 | v43.38,53.75 41.96,53.75 U1.51
  Top 0.254: U1.51 41.88,53.67
  Bottom 0.203: v49.68,61.27 v51.31,61.27 | v43.38,53.75 46.56,53.75 v48.28,55.47
JTAG_TDO
  Top 0.203: 50.49,63.09 49.38,63.09 48.56,62.28 47.75,62.28 J2.6 | 50.49,63.09 51.21,63.09 R12.3 | 50.49,63.09 50.49,60.45 48.46,58.42 45.82,58.42 43.89,56.49 41.25,56.49 40.44,55.68 40.44,53.75 U1.54
JTAG_TMS  (via drill 0.51)
  Top 0.203: J2.2 47.75,64.72 R12.1 51.31,64.72 51.92,65.33 53.09,65.33 53.26,65.15 53.26,57.17 v53.01,56.92 | v41.45,57.3 39.93,55.78 39.93,53.75 U1.55
  Bottom 0.203: v41.45,57.3 41.83,57.3 42.47,56.67 52.76,56.67 v53.01,56.92
LDAQ_ID_SCL  (via drill 0.51)
  Top 0.203: SLOT3.A7 113.06,79.86 114.59,78.34 114.59,62.23 | v112.55,37.95 v112.56,37.95 SLOT2.A7 112.62,51.75 112.62,53.25 113,53.25 113.5,53.75 113.5,55.25 113.12,55.25 112.5,55.88 112.5,57 114.38,58.88 114.38,62.25 114.46,62.23 114.59,62.23 | U1.63 35.88,63.28 v36.4,63.8 | v65.53,60.96 74.3,60.96 75.56,62.23 v80.14,62.23 | v116.2,62.23 114.59,62.23
  Bottom 0.203: v112.55,37.95 112.55,33.96 111.56,32.97 111.56,30.94 SLOT1.A7 | v36.4,63.8 38.63,66.04 60.45,66.04 v65.53,60.96 | v80.14,62.23 v116.2,62.23 | SLOT0.A7 112.5,8 111.5,9 111.5,11 110.5,12 110.5,15.75 110.62,15.88 110.65,15.91
  Bottom 0.254: 110.65,15.91 113.67,18.92 113.67,22.23 112.56,23.34 SLOT1.A7
LDAQ_ID_SDA  (via drill 0.51)
  Top 0.203: SLOT3.A8 111.56,68.97 113.46,67.06 113.46,65.1 | 113.46,65.1 v113.46,61.04 | SLOT2.A8 111.56,37.42 112.55,36.42 112.55,33.96 111.56,32.97 SLOT1.A8 111.43,27.82 111.43,13.97 110.96,13.5 | U1.64 35.38,64.41 v36.12,65.15 | v79.25,63.37 78.61,62.74 75.31,62.74 74.04,61.47 67.56,61.47 v67.06,61.98 | v113.31,65.15 113.41,65.15 113.46,65.1 | 110.96,13.47 110.96,13.5 | SLOT0.A8 111.5,6 111.5,11.38 111.12,11.38 110.5,12 110.5,13.5 110.88,13.5 110.96,13.5
  Bottom 0.203: v113.46,61.04 112.57,60.15 112.57,55.88 111.73,54.99 111.56,54.81 SLOT2.A8 | v36.12,65.15 38.02,67.06 61.98,67.06 v67.06,61.98 | v79.25,63.37 111.53,63.37 v113.31,65.15
LDAQ_RESET  (via drill 0.51)
  Top 0.203: v107.57,58.34 109.47,60.25 109.47,64.52 v106.55,67.44 | U1.41 50.97,47.16 54.61,50.8 61.59,50.8 62.87,52.07 62.87,59.69 70.48,67.31 v71.12,67.31
  Bottom 0.203: v107.57,58.34 107.54,58.32 105.31,58.32 104.55,57.56 104.55,55.73 103.56,54.74 103.56,52.93 104.56,51.93 SLOT2.A13 105.25,51.73 106.81,50.16 106.81,38.23 104.56,35.98 104.56,33.94 103.56,32.94 103.56,30.94 SLOT1.A13 103.49,28.87 103.17,28.87 102.62,28.33 102.62,22.08 104.32,20.39 104.32,19.71 102.52,17.92 102.52,11.96 101.59,11.03 101.59,9.87 101.98,9.48 SLOT0.A13 | v71.12,67.31 106.33,67.31 106.46,67.44 v106.55,67.44 106.59,67.44 106.59,78.59 105.32,79.86 SLOT3.A13
LDAQ_RXD  (via drill 0.51, 0.6)
  Top 0.203: SLOT1.A28 89.56,26.67 87.5,24.62 v86.49,24.62 | U1.21 39.88,35.23 41.59,33.51 61.16,33.51 71.07,23.61 v71.45,23.61 71.81,23.24 v82.82,23.24 | v71.75,14.97 76.2,10.53 77.78,10.53 81.56,6.74 84.99,6.74 85.24,6.99 86,6.99 86.16,6.84 88.6,6.84 SLOT0.A28 | SLOT3.A28 89.56,76.97 91.33,75.19 91.33,62.23 88.57,59.47 88.57,58.51 v88.52,58.45 | SLOT2.A28 89.56,48.96 88.47,47.88 88.47,36.7 v88.54,36.62
  Bottom 0.203: v86.49,24.62 85.47,24.62 84.09,23.24 v82.82,23.24 | v71.75,14.97 71.75,23.3 v71.45,23.61 | v88.52,58.45 88.52,55.74 89.56,54.7 SLOT2.A28 | v88.54,36.62 88.54,33.96 89.56,32.95 SLOT1.A28
LDAQ_SCK  (via drill 0.51)
  Top 0.203: U1.24 41.38,36.46 41.91,35.92 61.72,35.92 68.64,29 68.45,28.81 | v88.9,23.86 88.52,23.48 83.95,23.48 83.31,24.11 73.03,24.11 68.39,28.75 68.45,28.81 | v68.61,28.81 68.45,28.81 | SLOT3.A26 92.83,76.59 92.83,60.65 v90.55,58.38 | v90.56,36.66 90.58,36.67 90.58,44.54 91.56,45.51 SLOT2.A26 | v69.22,14.97 69.22,11.79 77.22,3.79 89.46,3.79 SLOT0.A26
  Bottom 0.203: v69.22,14.97 69.22,28.2 v68.61,28.81 | v90.55,58.38 90.55,55.69 91.57,54.67 91.56,54.66 SLOT2.A26 | v90.56,36.66 90.56,33.92 91.56,32.93 SLOT1.A26 91.57,26.65 88.9,23.99 v88.9,23.86
LDAQ_TXD  (via drill 0.51)
  Top 0.203: v70.48,14.97 75.56,9.89 77.53,9.89 82.97,4.45 86.12,4.45 SLOT0.A30 | U1.5 31.88,33.59 v31.39,33.11 | v43.18,34.66 v61.59,34.66 | v65.53,33.38 65.47,33.32 70.79,28 v70.71,27.92 73.76,24.88 84.84,24.88 87.56,27.59 SLOT1.A30 87.56,32.93 86.53,33.96 86.53,36.59 87.56,37.62 SLOT2.A30 87.56,54.68 86.56,55.67 86.56,58.72 87.56,59.71 88.03,59.71 89.33,61.01 89.33,76.16 88.86,76.63 88.78,76.63 SLOT3.A30
  Bottom 0.203: v31.39,33.11 31.9,33.61 31.9,36.71 33.02,37.83 41.27,37.83 41.91,37.2 41.91,35.92 v43.18,34.66 | v65.53,33.38 62.87,33.38 v61.59,34.66 | v70.48,14.97 70.48,27.92 v70.71,27.92
N$1
  Top 0.203: 29.84,53.69 29.84,54.34 29.21,54.34 28.38,53.51 25.84,53.51 24.94,54.42 C1.2
  Top 0.254: Y1.3 21.13,56.2 22.75,54.58 C1.2 24.94,54.65 | 29.84,53.69 U1.75
N$2
  Top 0.203: U1.74 30.38,54.52 29.62,55.28 28.73,55.28 25.51,58.49 Y1.1
  Top 0.254: Y1.1 24.27,59.92 C2.2
N$3
  Top 0.203: R1.2 16.82,47.29 24.81,47.29 26.68,49.16 U1.81
N$4
  Top 0.203: R2.2 21.52,48.39 25.04,48.39 25.7,49.05 25.7,49.07 26.29,49.66 U1.80
N$5  (via drill 0.51)
  Top 0.203: v21.34,46.47 19.55,46.47 C3.2 19.47,46.39 R3.2 | U1.78 24.32,50.66 v23.5,49.77
  Bottom 0.203: v23.5,49.77 22.42,49.77 21.34,48.69 v21.34,46.47
N$6
  Top 0.254: U1.42 47.24,47.66 R4.2
N$11
  Top 0.406: USB.VBUS 10.24,38.63 L2.2
N$12
  Top 0.406: U2.5 L3.1
N$15
  Top 0.203: R5.2 12.32,72.01 13.34,73.03 16.51,73.03 17.14,72.39 SJ1.2
N$16
  Top 0.203: LED1.2 21.03,19.75 R29.2
N$17
  Top 0.254: C10.1 50.18,27.7 50.7,27.18 50.67,27.14 U3.10
N$18
  Top 0.254: U5.4 40.4,17.61 39.65,16.86 39.65,16.26 39.36,15.96 T1.3
N$27  (via drill 0.51, 0.6)
  Top 0.203: v38.1,56.18 38.38,55.9 U1.58
  Top 0.406: R17.1 74.3,65.77 v73.66,65.14
  Bottom 0.254: 38.67,58.15 64.9,58.15
  Bottom 0.406: 38.67,58.15 38.1,57.58 v38.1,56.18 | 64.9,58.15 71.88,65.14 v73.66,65.14
N$30
  Top 0.203: C8.2 29.27,35.34 29.27,35.92 29.46,36.12 30.04,36.12 30.38,36.46 U1.2 30.38,38.63 29.83,39.18 29.83,40.09 30.4,40.66 31.43,40.66 31.93,40.17 31.93,39.18 31.38,38.62 U1.4
  Top 0.254: C8.2 28.9,35.25 28.57,34.92 27.52,34.92 L4.2 27.5,32.11 C14.2
N$31
  Top 0.203: LED2.2 23.62,18.16 R27.2
N$32
  Top 0.203: LED3.2 26.16,18.16 R18.2
PA20_TXD1_3.3  (via drill 0.51, 0.6)
  Top 0.203: U1.19 38.88,36.38 v38.04,35.54 | v24.77,11.16 22.86,11.16 20.95,9.26 20.95,6.09 JP3.3
  Bottom 0.203: v38.04,35.54 38.04,33.32 37.47,32.75 33.66,32.75 28.57,27.67 28.57,14.97 v24.77,11.16
PA21_RXD1_3.3  (via drill 0.51, 0.6)
  Top 0.203: U1.20 39.38,33.85 v39.24,33.72 | v26.67,11.16 26.67,9.89 24.44,7.66 JP3.2
  Bottom 0.203: v26.67,11.16 29.84,14.34 29.84,27.67 34.29,32.12 38.37,32.12 39.24,32.99 v39.24,33.72
PA24_SCK1_3.3  (via drill 0.51, 0.6)
  Top 0.203: U1.23 40.88,35.5 v40.89,35.48 | v28.57,11.16 28.57,8.62 27.94,7.99 JP3.1
  Bottom 0.203: v40.89,35.48 40.89,32.37 40.01,31.48 34.92,31.48 33.02,29.57 33.02,28.94 31.11,27.04 31.11,13.7 v28.57,11.16
PB5
  Top 0.203: U1.97 25.99,41.16 23.41,38.58 23.41,30.12 21.98,28.7 17.53,28.7 17.39,28.7
  Top 0.254: 17.53,28.7 14.73,28.7 12.7,26.67 6.56,26.67 JP2.6
PB6
  Top 0.203: 14.69,26.16 16.19,27.67 22.23,27.67 23.89,29.33 23.89,38.22 26.33,40.66 U1.98
  Top 0.254: JP2.5 9.54,23.51 11.43,25.4 13.92,25.4 14.69,26.16
PB7
  Top 0.203: 16.76,25.38 18.41,27.04 22.86,27.04 24.37,28.55 24.37,37.98 26.55,40.16 U1.99
  Top 0.254: JP2.4 7.94,20.01 12.06,24.13 15.51,24.13 16.76,25.38
PB8
  Top 0.203: 16.95,24.3 19.05,26.4 22.92,26.4 24.83,28.3 24.83,37.68 26.81,39.66 U1.100
  Top 0.254: JP2.3 8.25,16.51 9.53,17.78 9.53,19.05 12.7,22.23 14.88,22.23 16.95,24.3
PB10_3.3
  Top 0.203: U1.70 32.38,59.06 31.11,60.33 31.11,65.41 25.4,71.12 25.4,73.46 U6.1
PB10_5.0
  Top 0.254: JP1.3 20.32,84.46 25.38,79.39 U6.20
PB14_3.3
  Top 0.203: U1.69 32.88,59.83 31.75,60.96 31.75,66.04 29.21,68.58 29.16,68.58 26.72,71.02 26.72,73.46 U6.3
PB14_5.0
  Top 0.254: JP1.4 26.7,81.14 U6.18
PB17_3.3
  Top 0.203: U1.68 33.38,60.6 32.38,61.59 32.38,67.31 31.11,68.58 | U6.4 27.43,73.46 27.43,72.24 30.68,68.99 30.73,68.96
  Top 0.254: 31.11,68.58 30.73,68.96
PB17_5.0
  Top 0.254: JP1.5 27.35,83.99 U6.17
PB18_3.3
  Top 0.203: U1.67 33.88,61.37 33.02,62.23 33.02,69.29 31.5,69.29 28.04,72.75 28.04,73.46 U6.5
PB18_5.0
  Top 0.254: JP1.6 28,82.08 U6.16
PB19_3.3
  Top 0.203: U1.66 34.38,62.14 33.66,62.87 33.66,70.48 33.63,70.51 30.89,70.51 28.65,72.75 28.65,73.46 U6.6
PB19_5.0  (via drill 0.51)
  Top 0.203: U6.15 28.65,78.64 v29.36,77.93
  Bottom 0.203: v29.36,77.93 29.57,77.93 31.9,80.26 32.61,80.26 33.02,79.86 33.73,79.86 34.24,80.37 34.24,84.12 33.93,84.43 JP1.7
PB20_3.3
  Top 0.203: U1.65 34.88,67.77 | U6.7 29.36,73.46 29.36,72.64 31.09,70.92 33.83,70.92 34.75,70 34.75,67.97 34.8,67.85
  Top 0.254: 34.88,67.77 34.8,67.85
PB20_5.0
  Top 0.254: 29.3,80.19 U6.14 29.3,82 30.48,83.19 36.1,83.19 JP1.8
PB23_3.3
  Top 0.203: U1.62 36.38,62.51 37.34,63.48 | U6.8 29.97,73.46 29.97,72.75 30.28,72.44 33.93,72.44 34.34,72.85 34.43,72.88
  Top 0.254: 37.34,63.48 37.34,69.98 34.43,72.88
PB23_5.0
  Top 0.254: JP1.9 38.97,82.55 30.99,82.55 29.95,81.51 U6.13
PWRIN
  Top 0.508: 45.97,12.43 D2.2
  Top 0.61: 42.55,12.43 42.27,12.43 J1.1
  Top 0.762: 45.97,12.43 42.55,12.43
RS485_N
  Top 0.203: JP6.2 8.55,64.88 U4.7 17.08,64.88 19.75,67.55 19.75,70.56 SJ1.1
RS485_P
  Top 0.203: U4.6 12.33,66.15 R5.1 10.77,66.16 JP6.3
RS485_RX  (via drill 0.51)
  Top 0.203: U1.18 38.38,45.81 37.47,46.72 37.47,46.74 36.96,47.24 35.81,47.24 35.05,48.01 35.05,50.42 v34.54,50.93 | U4.1 22.19,64.26 26.04,64.26 v26.54,63.75
  Bottom 0.203: v34.54,50.93 34.54,51.18 31.75,53.98 31.75,57.53 26.54,62.74 v26.54,63.75
RS485_TX  (via drill 0.51)
  Top 0.203: U1.17 37.88,45.46 36.73,46.61 35.31,46.61 34.29,47.62 34.29,49.53 v33.02,50.8 | v24.64,66.8 22.16,66.8 U4.4
  Bottom 0.203: v33.02,50.8 30.48,53.34 30.48,58.04 25.02,63.5 25.02,66.42 v24.64,66.8
RS485_TXEN
  Top 0.203: U4.3 U4.2 27.19,64.88 28.07,64.01 28.07,61.83 31.88,58.02 U1.71
SLOT0_CTRL0  (via drill 0.6)
  Top 0.203: U1.6 32.38,31.49 v34.92,28.94
  Bottom 0.203: v34.92,28.94 51.44,28.94 55.88,24.5 55.88,16.24 70.1,2.02 99.44,2.02 99.69,2.02 SLOT0.A14
SLOT0_CTRL1  (via drill 0.6)
  Top 0.203: U1.7 32.88,32.7 33,32.7 v35.43,30.27
  Bottom 0.203: SLOT0.A16 98.32,2.65 71.37,2.65 57.78,16.24 57.78,24.5 52.45,29.83 35.88,29.83 v35.43,30.27
SLOT0_CTRL2  (via drill 0.6)
  Top 0.203: U1.8 33.38,33.85 33.38,33.31 35.26,31.43 35.61,31.43 37.1,29.94 37.1,29.88 51.77,29.88 57.15,24.5 57.15,24.11 v56.77,23.73 | SLOT0.A18 99.17,5.88 95.94,2.65 71.37,2.65 56.77,17.26 v56.77,17.89
  Bottom 0.203: v56.77,23.73 v56.77,17.89
SLOT0_CTRL3  (via drill 0.6)
  Top 0.203: U1.10 34.31,34 34.31,33.59 37.53,30.38 52.54,30.38 v59.05,23.86 | SLOT0.A20 94.89,3.22 72.71,3.22 59.05,16.88 v59.05,17.51
  Bottom 0.203: v59.05,23.86 v59.05,17.51
SLOT1_CTRL0  (via drill 0.51)
  Top 0.203: U1.11 34.88,33.69 37.64,30.92 55.17,30.92 66.04,20.05 84.58,20.05 86.23,18.4 v86.87,18.4 | SLOT1.A14 103.56,20.1 v103.5,20.05
  Bottom 0.203: v103.5,20.05 101.85,18.4 v86.87,18.4
SLOT1_CTRL1  (via drill 0.51)
  Top 0.203: U1.12 35.38,33.85 37.74,31.48 55.88,31.48 66.67,20.68 85.85,20.68 v85.98,20.56 | SLOT1.A16 101.56,20.64 v101.47,20.56
  Bottom 0.203: v101.47,20.56 v85.98,20.56
SLOT1_CTRL2  (via drill 0.51)
  Top 0.203: U1.13 35.88,34.06 37.85,32.09 56.59,32.09 67.21,21.47 v87.02,21.47 | SLOT1.A18 99.56,21.59 v99.57,21.57
  Bottom 0.203: v87.02,21.47 87.05,21.45 99.44,21.45 v99.57,21.57
SLOT1_CTRL3  (via drill 0.51)
  Top 0.203: U1.14 36.38,34.47 38.1,32.75 57.15,32.75 67.69,22.21 85.34,22.21 v85.6,22.46 | v97.56,23.89 97.56,25.92 SLOT1.A20
  Bottom 0.203: v85.6,22.46 96.14,22.46 v97.56,23.89
SLOT2_CTRL0  (via drill 0.51)
  Top 0.203: U1.37 53.69,45.16 55.88,47.35 67.94,47.35 v68.07,47.23
  Bottom 0.203: SLOT2.A14 103.56,47.15 102.49,46.09 72.52,46.09 71.37,47.23 v68.07,47.23
SLOT2_CTRL1  (via drill 0.51)
  Top 0.203: U1.38 52.92,45.66 55.37,48.12 v70.1,48.12
  Bottom 0.203: SLOT2.A16 101.56,47.82 100.33,46.59 72.9,46.59 71.37,48.12 v70.1,48.12
SLOT2_CTRL2  (via drill 0.51)
  Top 0.203: U1.39 52.15,46.16 54.74,48.75 68.83,48.75 v69.09,49.01
  Bottom 0.203: SLOT2.A18 99.56,48.61 98.04,47.1 73.41,47.1 71.5,49.01 v69.09,49.01
SLOT2_CTRL3  (via drill 0.51)
  Top 0.203: U1.40 51.38,46.66 54.61,49.9 v67.82,49.9
  Bottom 0.203: SLOT2.A20 97.81,49.47 97.81,48.64 96.77,47.61 73.53,47.61 71.25,49.9 v67.82,49.9
SLOT3_CTRL0  (via drill 0.51)
  Top 0.203: U1.93 29.44,43.16 v30.38,42.22 | v60.96,53.98 60.96,59.05 v69.85,67.94
  Bottom 0.203: SLOT3.A14 103.56,74.98 97.16,68.58 70.48,68.58 v69.85,67.94 | v30.38,42.22 50.11,42.22 58.42,50.53 58.42,51.44 v60.96,53.98
SLOT3_CTRL1  (via drill 0.51)
  Top 0.203: U1.92 30.99,43.66 v31.55,43.1 | v59.05,53.98 59.05,59.69 67.31,67.94 v67.94,67.94
  Bottom 0.203: SLOT3.A16 94.81,71.12 71.75,71.12 68.58,67.94 v67.94,67.94 | v31.55,43.1 49.72,43.1 57.78,51.16 57.78,52.7 v59.05,53.98
SLOT3_CTRL2  (via drill 0.51)
  Top 0.203: U1.91 31.12,44.16 v31.55,44.59 | v57.15,53.98 57.15,59.05 v65.41,67.31
  Bottom 0.203: SLOT3.A18 94.08,72.39 70.48,72.39 v65.41,67.31 | v31.55,44.59 33.41,44.59 34.25,43.75 49.1,43.75 57.15,51.8 v57.15,53.98
SLOT3_CTRL3  (via drill 0.51)
  Top 0.203: U1.90 29.54,44.66 v30.38,45.5 | v55.88,53.34 55.88,65.41 58.42,67.94 v62.87,67.94
  Bottom 0.203: SLOT3.A20 93.36,73.66 69.22,73.66 63.18,67.63 v62.87,67.94 | v30.38,45.5 30.94,45.5 31.17,45.73 33.6,45.73 34.9,44.43 48.51,44.43 55.88,51.8 v55.88,53.34
USB_D_N
  Top 0.203: USB.D- 11.48,49.98 12.26,49.19 Z2.2 14.1,49.19 14.61,49.7 17.46,49.7 17.71,49.46 17.91,49.26 18.06,49.11 R2.1 18.06,48.97 18.48,49.39 arc-90 19.56,50.47 arc98 19.88,50.72 arc-165 20.57,50.78 arc167 21.14,50.85 arc-180 21.72,50.85 arc180 22.35,50.85 arc-90 22.67,51.16 22.86,51.16 U1.77
USB_D_P
  Top 0.203: USB.D+ 8.26,50.28 9.46,51.48 12,51.48 12.57,50.91 13.58,50.91 Z1.2 15.66,50.92 R1.1 16.39,51.66 U1.76
USB_GND  (via drill 0.51)
  Top 0.203: U1.82 v29.81,48.66 | v17.78,42.91 17.78,44.24 R3.1
  Top 0.406: PT1.1 13.84,39.97 v12.37,41.45
  Bottom 0.203: v29.81,48.66 29.81,48.59 29.27,48.05 24.19,48.05 23.5,47.35 23.5,44.18 22.23,42.91 v17.78,42.91
  Bottom 0.406: v12.37,41.45 12.37,42.55 8.16,46.74 8.16,47.38 USB.GND
  other vias: 12.37,45.64 8.26,44.91 10.16,53.17 12.45,54.31 8.26,41.1 5.71,46.19 5.71,48.73 5.71,51.27 14.27,45.64 16.18,45.64 14.27,43.73 16.18,43.73 12.37,43.73 14.27,41.45 14.35,54.31
  pour Top (isolate 0.305): 3.17,39.84 3.17,57.62 13.34,57.62 14.1,56.85 14.52,56.34 18.29,52.7 13.97,52.7 14.1,40.34 13.59,39.84
  pour Bottom (isolate 0.305): 3.17,39.84 3.17,57.62 13.34,57.62 18.41,52.53 24.38,52.53 26.86,51.88 29.02,51.76 30.16,49.22 30.1,47.95 28.77,47.44 23.5,47.35 23.5,44.26 22.38,42.99 17.72,42.91 16.83,42.93 15.88,41.72 15.88,39.84
  pour Top (isolate 0.305): 13.34,39.84 15.88,39.84 15.88,41.87 17.65,43.9 17.65,46.44 14.1,46.44 14.1,40.6
USBVCC  (via drill 0.6)
  Top 0.203: L2.1 5.74,37.8 5.71,37.83
  Top 0.406: C7.A 3.43,36.64 4.68,37.89 | 4.68,37.89 C6.1 7.52,37.89 L2.1 | v36.01,14.91 36.01,16.5 T1.1 | v3.17,38.47 4.11,38.47 4.68,37.89
  Bottom 0.406: v3.17,38.47 3.17,13.19 5.14,11.22 17.08,11.22 19.05,9.26 30.35,9.26 v36.01,14.91
VDD_UTMI  (via drill 0.51)
  Top 0.203: U1.79 25.67,50.16 v24.89,49.39 | v21.53,44.62 21.53,44.24 18.76,41.47 C17.1
  Top 0.406: L1.1 17.44,37.98 18.14,38.68 18.71,38.68 18.78,38.76 18.78,39.55 C17.1
  Bottom 0.203: v24.89,49.39 24.7,49.39 24.07,48.75 22.8,48.75 22.42,48.37 22.42,45.51 v21.53,44.62
VIN  (via drill 0.6)
  Top 0.254: v48.72,26.37 49.99,26.37 50.2,26.15 50.17,26.12 U3.11 | v49.99,21.03 50.24,21.03 50.7,21.49 50.67,21.53 U3.3 | 50.2,21.25 v49.99,21.03 | R8.2 49.98,16.09 C22.1 | v49.99,21.03 50.17,21.21 U3.2
  Top 0.508: 50.8,10.53 50.8,11.7 D2.1 50.22,12.35 50.22,15.17
  Top 0.61: 50.05,20.97 C21.1 C22.1 50.22,15.88 50.22,15.17 | PC1.+ 49.71,9.44 50.8,10.53
  Top 1.016: 50.05,20.97 v49.99,21.03
  Bottom 0.254: v48.72,26.37 48.72,22.3 v49.99,21.03

## Text on the board
tPlace: LDAQ SLOT #3 | LDAQ SLOT #2 | Open Source / Hardware | LDAQ SLOT #1 | TP (5V) | LDAQ SLOT #0 | Model: BASE / Rev: 2021-02 | EXT. DC IN / 7-24V
tNames: GND | +5V | PB10 | PB14 | PB17 | PB18 | PB19 | PB20 | PB23 | 5V CMOS I/Os | No end / load | D+ | D- | Vcc | GND | TMS | TCK | TDO | TDI | RS485 | /RST | PB5 | PB6 | PB7 | PB8 | +5V | Warning: 3.3V I/O only | GND | GND | +3.3V | TX1 | RX1 | SCK1